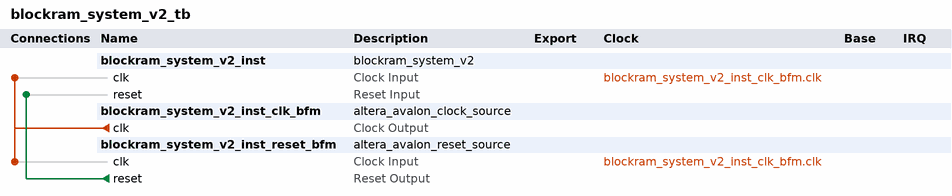
[diagram p0: system contents]
# Platform Designer (Qsys) system blockram_system_v2_tb, Cyclone 10 LP 10CL025YE144C8G
# Parameters at their usual value, and those the tool derives, are not listed.
package require -exact qsys 22.1
create_system blockram_system_v2_tb
set_project_property DEVICE_FAMILY {Cyclone 10 LP}
set_project_property DEVICE 10CL025YE144C8G

add_instance blockram_system_v2_inst blockram_system_v2 1.0

add_instance blockram_system_v2_inst_clk_bfm altera_avalon_clock_source 22.1

add_instance blockram_system_v2_inst_reset_bfm altera_avalon_reset_source 22.1
set_instance_parameter_value blockram_system_v2_inst_reset_bfm ASSERT_HIGH_RESET 0
set_instance_parameter_value blockram_system_v2_inst_reset_bfm INITIAL_RESET_CYCLES 50

# connections
add_connection blockram_system_v2_inst_clk_bfm.clk blockram_system_v2_inst.clk clock
add_connection blockram_system_v2_inst_clk_bfm.clk blockram_system_v2_inst_reset_bfm.clk clock
add_connection blockram_system_v2_inst_reset_bfm.reset blockram_system_v2_inst.reset reset

set_interconnect_requirement {$system} qsys_mm.clockCrossingAdapter HANDSHAKE
set_interconnect_requirement {$system} qsys_mm.enableEccProtection FALSE
set_interconnect_requirement {$system} qsys_mm.insertDefaultSlave FALSE
set_interconnect_requirement {$system} qsys_mm.maxAdditionalLatency 1

save_system blockram_system_v2_tb.qsys
